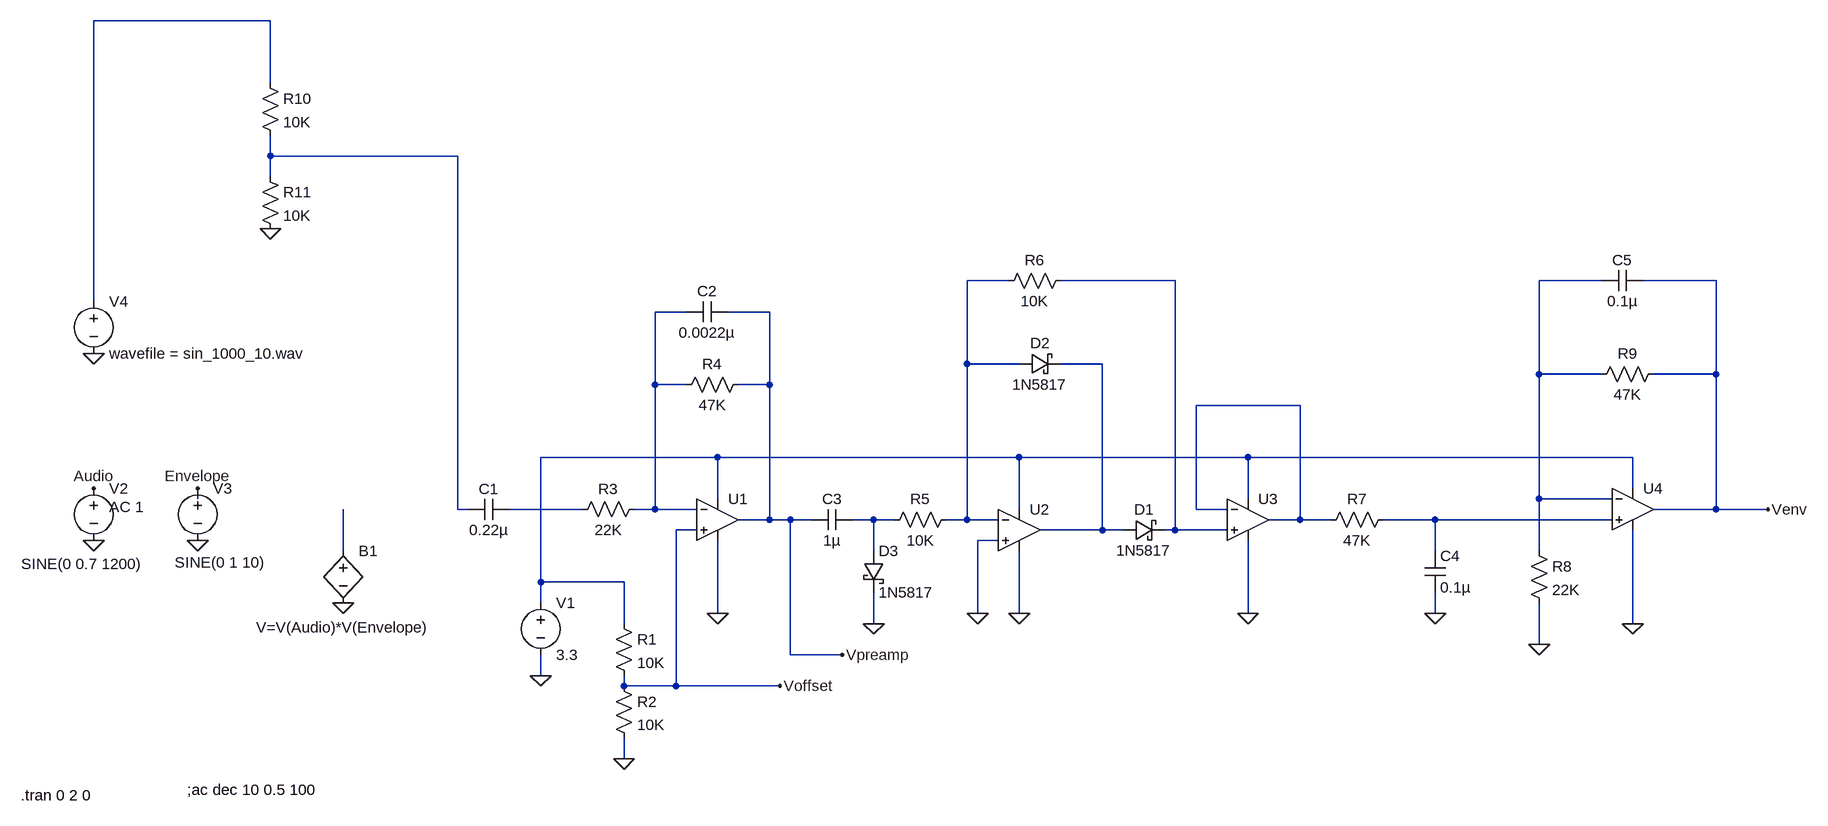
[diagram p0: schematic Analog.asc]
Analog.asc, the LTspice schematic file:
Version 4
SHEET 1 1884 680
WIRE -496 -592 -768 -592
WIRE -496 -496 -496 -592
WIRE -496 -384 -496 -416
WIRE -208 -384 -496 -384
WIRE -496 -352 -496 -384
WIRE 640 -192 576 -192
WIRE 896 -192 720 -192
WIRE 1552 -192 1456 -192
WIRE 1728 -192 1616 -192
WIRE -768 -160 -768 -592
WIRE 144 -144 96 -144
WIRE 272 -144 208 -144
WIRE 576 -64 576 -192
WIRE 656 -64 576 -64
WIRE 784 -64 720 -64
WIRE 1456 -48 1456 -192
WIRE 1552 -48 1456 -48
WIRE 1728 -48 1728 -192
WIRE 1728 -48 1632 -48
WIRE 96 -32 96 -144
WIRE 144 -32 96 -32
WIRE 272 -32 272 -144
WIRE 272 -32 224 -32
WIRE 1088 0 928 0
WIRE 192 80 -80 80
WIRE 656 80 192 80
WIRE 1008 80 656 80
WIRE 1600 80 1008 80
WIRE 1600 128 1600 80
WIRE -608 144 -608 128
WIRE 192 144 192 80
WIRE 1008 144 1008 80
WIRE 1456 144 1456 -48
WIRE 1568 144 1456 144
WIRE -208 160 -208 -384
WIRE -192 160 -208 160
WIRE -16 160 -128 160
WIRE 96 160 96 -32
WIRE 96 160 64 160
WIRE 160 160 96 160
WIRE 656 160 656 80
WIRE 928 160 928 0
WIRE 976 160 928 160
WIRE 1728 160 1728 -48
WIRE 1728 160 1632 160
WIRE 1808 160 1728 160
WIRE 272 176 272 -32
WIRE 272 176 224 176
WIRE 304 176 272 176
WIRE 336 176 304 176
WIRE 432 176 400 176
WIRE 464 176 432 176
WIRE 576 176 576 -64
WIRE 576 176 544 176
WIRE 624 176 576 176
WIRE 1088 176 1088 0
WIRE 1088 176 1040 176
WIRE 1136 176 1088 176
WIRE 1296 176 1216 176
WIRE 1568 176 1296 176
WIRE 160 192 128 192
WIRE 784 192 784 -64
WIRE 784 192 688 192
WIRE 816 192 784 192
WIRE 896 192 896 -192
WIRE 896 192 880 192
WIRE 976 192 896 192
WIRE 624 208 592 208
WIRE -384 224 -384 160
WIRE 432 224 432 176
WIRE 1296 224 1296 176
WIRE 1456 224 1456 144
WIRE -80 272 -80 80
WIRE 48 272 -80 272
WIRE -80 304 -80 272
WIRE 192 320 192 208
WIRE 592 320 592 208
WIRE 656 320 656 224
WIRE 1008 320 1008 208
WIRE 1296 320 1296 288
WIRE 48 336 48 272
WIRE 432 336 432 288
WIRE 1600 336 1600 192
WIRE 1456 368 1456 304
WIRE 304 384 304 176
WIRE 384 384 304 384
WIRE -80 416 -80 384
WIRE 48 432 48 416
WIRE 128 432 128 192
WIRE 128 432 48 432
WIRE 288 432 128 432
WIRE 48 544 48 512
FLAG -768 128 Audio
FLAG -608 128 Envelope
FLAG 288 432 Voffset
FLAG 384 384 Vpreamp
FLAG 1008 320 0
FLAG 192 320 0
FLAG 48 544 0
FLAG -80 416 0
FLAG -384 304 0
FLAG -608 208 0
FLAG -768 208 0
FLAG 1296 320 0
FLAG 1600 336 0
FLAG 1456 368 0
FLAG 1808 160 Venv
FLAG 656 320 0
FLAG 592 320 0
FLAG 432 336 0
FLAG -768 -80 0
FLAG -496 -272 0
SYMBOL OpAmps\\UniversalOpamp2 192 176 R0
SYMATTR InstName U1
SYMBOL res 32 320 R0
SYMATTR InstName R1
SYMATTR Value 10K
SYMBOL res 32 416 R0
SYMATTR InstName R2
SYMATTR Value 10K
SYMBOL voltage -80 288 R0
WINDOW 123 0 0 Left 0
WINDOW 39 0 0 Left 0
SYMATTR InstName V1
SYMATTR Value 3.3
SYMBOL res -32 176 R270
WINDOW 0 32 56 VTop 2
WINDOW 3 0 56 VBottom 2
SYMATTR InstName R3
SYMATTR Value 22K
SYMBOL res 128 -16 R270
WINDOW 0 32 56 VTop 2
WINDOW 3 0 56 VBottom 2
SYMATTR InstName R4
SYMATTR Value 47K
SYMBOL cap -192 176 R270
WINDOW 0 32 32 VTop 2
WINDOW 3 0 32 VBottom 2
SYMATTR InstName C1
SYMATTR Value 0.22µ
SYMBOL voltage -768 112 R0
WINDOW 123 24 44 Left 2
WINDOW 39 0 0 Left 0
WINDOW 3 -111 132 Left 2
SYMATTR Value2 AC 1
SYMATTR Value SINE(0 0.7 1200)
SYMATTR InstName V2
SYMBOL cap 144 -128 R270
WINDOW 0 32 32 VTop 2
WINDOW 3 0 32 VBottom 2
SYMATTR InstName C2
SYMATTR Value 0.0022µ
SYMBOL voltage -608 112 R0
WINDOW 3 -35 130 Left 2
WINDOW 123 -72 210 Left 2
WINDOW 39 0 0 Left 0
SYMATTR Value SINE(0 1 10)
SYMATTR InstName V3
SYMBOL bv -384 208 R0
WINDOW 3 -134 134 Left 2
SYMATTR Value V=V(Audio)*V(Envelope)
SYMATTR InstName B1
SYMBOL cap 336 192 R270
WINDOW 0 32 32 VTop 2
WINDOW 3 0 32 VBottom 2
SYMATTR InstName C3
SYMATTR Value 1µ
SYMBOL OpAmps\\UniversalOpamp2 1008 176 R0
SYMATTR InstName U3
SYMBOL res 1120 192 R270
WINDOW 0 32 56 VTop 2
WINDOW 3 0 56 VBottom 2
SYMATTR InstName R7
SYMATTR Value 47K
SYMBOL cap 1280 224 R0
SYMATTR InstName C4
SYMATTR Value 0.1µ
SYMBOL OpAmps\\UniversalOpamp2 1600 160 R0
SYMATTR InstName U4
SYMBOL res 1440 208 R0
SYMATTR InstName R8
SYMATTR Value 22K
SYMBOL res 1536 -32 R270
WINDOW 0 32 56 VTop 2
WINDOW 3 0 56 VBottom 2
SYMATTR InstName R9
SYMATTR Value 47K
SYMBOL cap 1616 -208 R90
WINDOW 0 0 32 VBottom 2
WINDOW 3 32 32 VTop 2
SYMATTR InstName C5
SYMATTR Value 0.1µ
SYMBOL res 448 192 R270
WINDOW 0 32 56 VTop 2
WINDOW 3 0 56 VBottom 2
SYMATTR InstName R5
SYMATTR Value 10K
SYMBOL OpAmps\\UniversalOpamp2 656 192 R0
SYMATTR InstName U2
SYMBOL schottky 816 208 R270
WINDOW 0 32 32 VTop 2
WINDOW 3 0 32 VBottom 2
SYMATTR InstName D1
SYMATTR Value 1N5817
SYMATTR Description Diode
SYMATTR Type diode
SYMBOL schottky 656 -48 R270
WINDOW 0 32 32 VTop 2
WINDOW 3 0 32 VBottom 2
SYMATTR InstName D2
SYMATTR Value 1N5817
SYMATTR Description Diode
SYMATTR Type diode
SYMBOL res 624 -176 R270
WINDOW 0 32 56 VTop 2
WINDOW 3 0 56 VBottom 2
SYMATTR InstName R6
SYMATTR Value 10K
SYMBOL schottky 416 224 R0
SYMATTR InstName D3
SYMATTR Value 1N5817
SYMATTR Description Diode
SYMATTR Type diode
SYMBOL voltage -768 -176 R0
SYMATTR InstName V4
SYMATTR Value wavefile = sin_1000_10.wav
SYMBOL res -512 -512 R0
SYMATTR InstName R10
SYMATTR Value 10K
SYMBOL res -512 -368 R0
SYMATTR InstName R11
SYMATTR Value 10K
TEXT -880 600 Left 2 !.tran 0 2 0
TEXT -624 592 Left 2 !;ac dec 10 0.5 100

The netlist it stands for:
* Analog.asc
XU1 Voffset N006 N009 0 Vpreamp level.2 Avol=1Meg GBW=10Meg Slew=10Meg ilimit=25m rail=0 Vos=0 phimargin=45 en=0 enk=0 in=0 ink=0 Rin=500Meg  ; pins IN+ IN- V+ V- OUT
R1 N009 Voffset 10K
R2 Voffset 0 10K
V1 N009 0 3.3
R3 N010 N006 22K
R4 N006 Vpreamp 47K
C1 N002 N010 0.22µ
V2 Audio 0 SINE(0 0.7 1200) AC 1
C2 N006 Vpreamp 0.0022µ
V3 Envelope 0 SINE(0 1 10)
B1 N013 0 V=V(Audio)*V(Envelope)
C3 Vpreamp N011 1µ
XU3 N004 N008 N009 0 N008 level.2 Avol=1Meg GBW=10Meg Slew=10Meg ilimit=25m rail=0 Vos=0 phimargin=45 en=0 enk=0 in=0 ink=0 Rin=500Meg  ; pins IN+ IN- V+ V- OUT
R7 N008 N012 47K
C4 N012 0 0.1µ
XU4 N012 N005 N009 0 Venv level.2 Avol=1Meg GBW=10Meg Slew=10Meg ilimit=25m rail=0 Vos=0 phimargin=45 en=0 enk=0 in=0 ink=0 Rin=500Meg  ; pins IN+ IN- V+ V- OUT
R8 N005 0 22K
R9 N005 Venv 47K
C5 Venv N005 0.1µ
R5 N011 N003 10K
XU2 0 N003 N009 0 N007 level.2 Avol=1Meg GBW=10Meg Slew=10Meg ilimit=25m rail=0 Vos=0 phimargin=45 en=0 enk=0 in=0 ink=0 Rin=500Meg  ; pins IN+ IN- V+ V- OUT
D1 N007 N004 1N5817
D2 N003 N007 1N5817
R6 N003 N004 10K
D3 N011 0 1N5817
V4 N001 0 wavefile = sin_1000_10.wav
R10 N001 N002 10K
R11 N002 0 10K
.model D D
.lib standard.dio
.tran 0 2 0
;ac dec 10 0.5 100
.lib UniversalOpamps2.sub
.backanno
.end